# Altium project KEY.PrjPcb
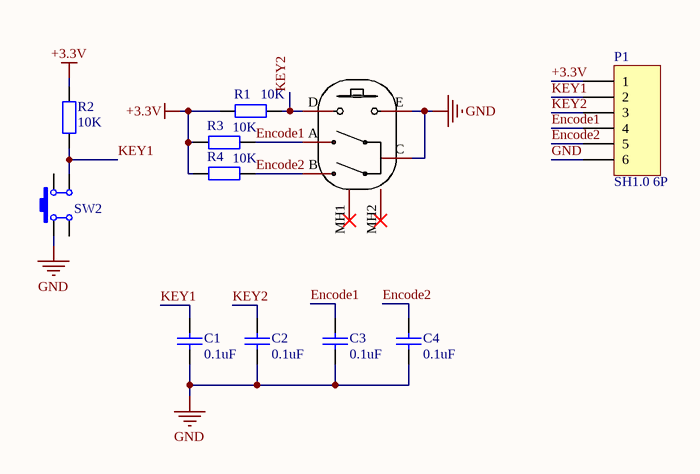
[diagram p0: KEY.SchDoc]
1 sheet, 11 parts. Net scope: global (net labels, ports and power ports of the same name join across sheets).
Board file: KEY.PcbDoc

## Sheet KEY.SchDoc
size A4

### Parts
C1  0.1uF  [C0603_L]
C2  0.1uF  [C0603_L]
C3  0.1uF  [C0603_L]
C4  0.1uF  [C0603_L]
P1  SH1.0 6P  [SH 1.0-WS-6P]
R1  10K  [R0603_L]
R2  10K  [R0603_L]
R3  10K  [R0603_L]
R4  10K  [R0603_L]
SW1  EC11K1524406  [SW-TH_EC11K1524406 - duplicate]  (value not drawn)
SW2  12x12x5  [SW DIP-12*12*4.3]  (value not drawn)

### Nets
+3.3V: P1.1 R1.2 R2.2 R3.2 R4.2
GND: C1.2 C2.2 C3.2 C4.2 P1.6 SW1.C SW1.E SW2.1
Encode1: C3.1 P1.4 R3.1 SW1.A
Encode2: C4.1 P1.5 R4.1 SW1.B
KEY1: C1.1 P1.2 R2.1 SW2.3
KEY2: C2.1 P1.3 R1.1 SW1.D

Not connected (* = marked no-connect by the designer): SW1 MH1* MH2*; SW2 2 4

### Notes on the sheet
- Size:
- Date:
- A4
- Author:
- Time:
- Revision:
- Sheet
- of
- File:

### Library data of the parts
C1-C4 = C: 贴片电容; BOM名称: 无极性贴片电容; 联系卖家，免费查找封装: 唯一出售店铺网址https://shop463601444.taobao.com
P1 = Header 6: Header, 6-Pin; LatestRevisionDate: 17-Jul-2002; LatestRevisionNote: Re-released for DXP Platform.; Publisher: Altium Limited
R1-R4 = R: 贴片电阻; 联系卖家，免费查找封装: 唯一出售店铺网址https://shop463601444.taobao.com; 封装库来自淘宝卖家ID：黄晶宝石: 其他店铺购入均为盗版假冒封装库，请立即申请退款; BOM名称: 贴片电阻
SW1 = EC11K1524406: Manufacturer: ALPSALPINE(阿尔卑斯阿尔派); Add into BOM: yes; Name: EC11K1524406; Symbol: EC11K1524406; Device: EC11K1524406; LCSC Part Name: 编码器; Supplier Part: C398934; Manufacturer Part: EC11K1524406; Supplier Footprint: 插件; JLCPCB Part Class: Extended Part; Datasheet: https://atta.szlcsc.com/upload/public/pdf/source/20190620/C398934_DDD5BF6D843226194F24C74B1929B82F.pdf; Supplier: LCSC; Convert to PCB: yes
SW2 = TSW DIP-12x12: 直插12x12轻触开关; 联系卖家，免费查找封装: 唯一出售店铺网址https://shop463601444.taobao.com; BOM名称: 直插12x12轻触开关